# Altium schematic sheet HEADERS & POWER.SchDoc
size B; Organization: Altium Limited; Address1: L3, 12a Rodborough Rd; Address2: Frenchs Forest; Address3: NSW; Address4: Australia 2086
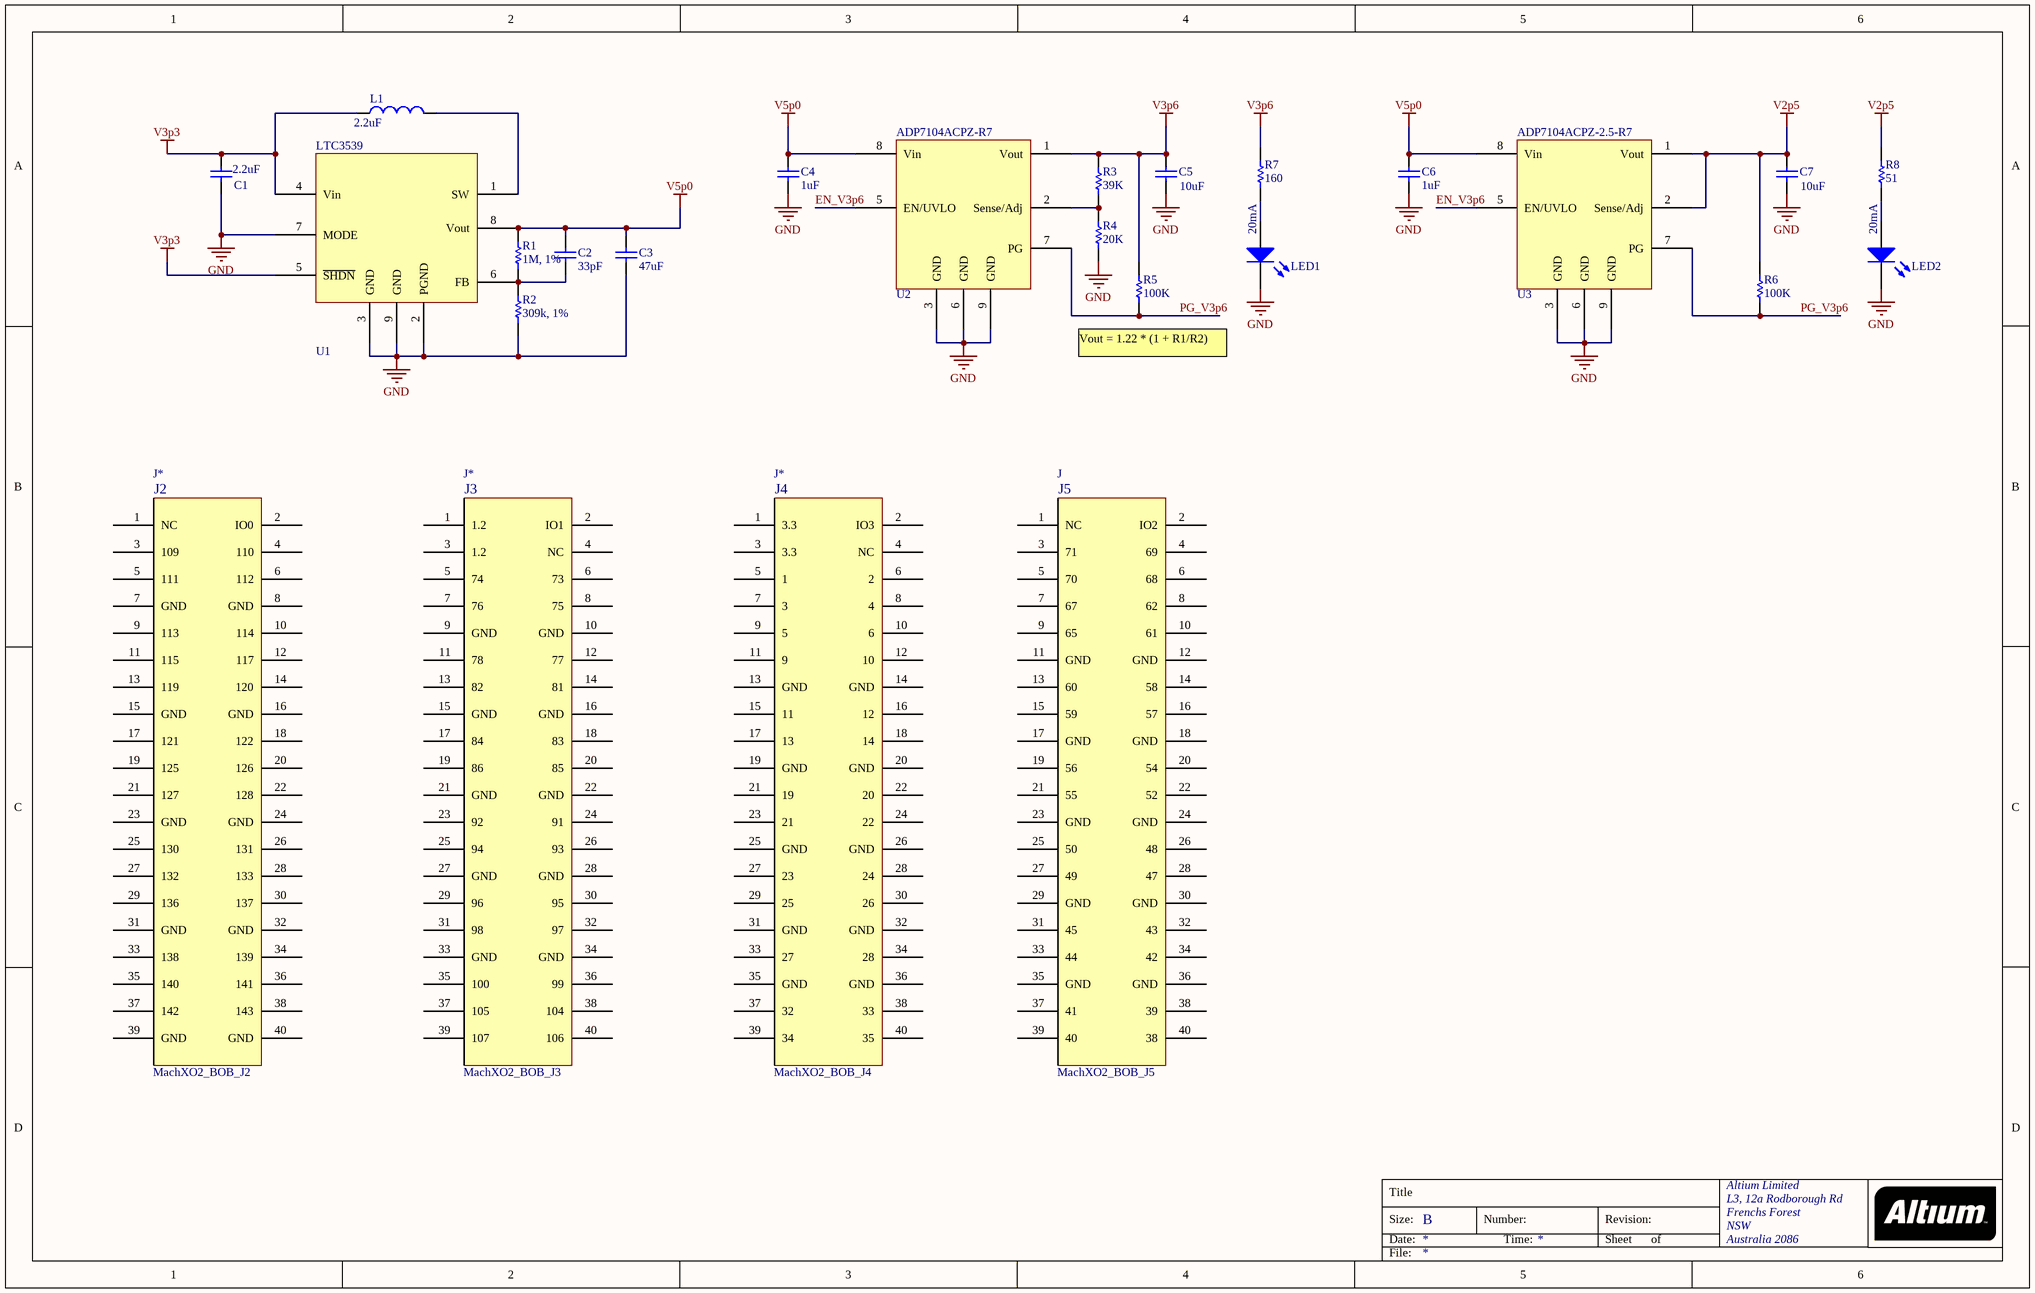
[diagram p0: HEADERS & POWER.SchDoc]

## Parts
(Parts that share a designator on the sheet are numbered #1, #2 ... from top to bottom, then left to right.)
C1  value 2.2uF  [CAPC1206(3216)170_N]  (hidden comment: 587-1329-2-ND)
C2  value 33pF  [CAPC01005(0402)22_N]  (hidden comment: CAP, 0402, 33pF)
C3  value 47uF  [CAPC1206(3216)170_N]  (hidden comment: CAP, 1206, 47uF)
C4  value 1uF  [CAPC01005(0402)22_N]  (hidden comment: CAP, 0402, 1uF)
C5  value 10uF  [CAPC0805(2012)130_N]  (hidden comment: CAP, 0805, 10uF)
C6  value 1uF  [CAPC01005(0402)22_N]  (hidden comment: CAP, 0402, 1uF)
C7  value 10uF  [CAPC0805(2012)130_N]  (hidden comment: CAP, 0805, 10uF)
J  MachXO2_BOB_J5  [RECEPTACLE_25.4MM_20X2]
J*#1  MachXO2_BOB_J2  [RECEPTACLE_25.4MM_20X2]
J*#2  MachXO2_BOB_J3  [RECEPTACLE_25.4MM_20X2]
J*#3  MachXO2_BOB_J4  [RECEPTACLE_25.4MM_20X2]
L1  value 2.2uF  [INDUCTOR, SMD, TDK]  (hidden comment: INDUCTOR, SMD, 2.2uF)
LED1  LED, GREEN, 0603, LITE-ON  [0603, LED]  (value not drawn)
LED2  LED, GREEN, 0603, LITE-ON  [0603, LED]  (value not drawn)
R1  value 1M, 1%  [RESC0402(1005)_N]  (hidden comment: RES, 0402, 1M, 1%)
R2  value 309k, 1%  [RESC0402(1005)_N]  (hidden comment: RES, 0402, 309k, 1%)
R3  39K  [RES, 0603]
R4  20K  [RES, 0603]
R5  100K  [RES, 0603]
R6  100K  [RES, 0603]
R7  160  [RESC1005X04N]
R8  51  [RESC1005X04N]
U1  LTC3539  [QFN45P300X200X80-8N]
U2  ADP7104ACPZ-R7  [QFN50P300X300X75-8N]
U3  ADP7104ACPZ-2.5-R7  [QFN50P300X300X75-8N]

## Nets
GND: C1.1 C3.1 C4.1 C5.1 C6.1 C7.1 LED1.1(C) LED2.1(C) R2.1 R4.1 U1.2(PGND) U1.3(GND) U1.7(MODE) U1.9(GND) U2.3(GND) U2.6(GND) U2.9(GND) U3.3(GND) U3.6(GND) U3.9(GND)
V2p5: C7.2 R6.2 R8.2 U3.1(Vout) U3.2(Sense/Adj)
V3p3: C1.2 L1.1 U1.4(Vin) U1.5(~{SHDN})
V3p6: C5.2 R3.2 R5.2 R7.2 U2.1(Vout)
V5p0: C2.2 C3.2 C4.2 C6.2 R1.2 U1.8(Vout) U2.8(Vin) U3.8(Vin)
EN_V3p6: U2.5(EN/UVLO) U3.5(EN/UVLO)
PG_V3p6: R5.1 R6.1 U2.7(PG) U3.7(PG)
NetC2_1: C2.1 R1.1 R2.2 U1.6(FB)
NetL1_2: L1.2 U1.1(SW)
NetLED1_2: LED1.2(A) R7.1
NetLED2_2: LED2.2(A) R8.1
NetR3_1: R3.1 R4.2 U2.2(Sense/Adj)

Not connected (* = marked no-connect by the designer): J 1(NC) 2(IO2) 3(71) 4(69) 5(70) 6(68) 7(67) 8(62) 9(65) 10(61) 11(GND) 12(GND) 13(60) 14(58) 15(59) 16(57) 17(GND) 18(GND) 19(56) 20(54) 21(55) 22(52) 23(GND) 24(GND) 25(50) 26(48) 27(49) 28(47) 29(GND) 30(GND) 31(45) 32(43) 33(44) 34(42) 35(GND) 36(GND) 37(41) 38(39) 39(40) 40(38); J*#1 1(NC) 2(IO0) 3(109) 4(110) 5(111) 6(112) 7(GND) 8(GND) 9(113) 10(114) 11(115) 12(117) 13(119) 14(120) 15(GND) 16(GND) 17(121) 18(122) 19(125) 20(126) 21(127) 22(128) 23(GND) 24(GND) 25(130) 26(131) 27(132) 28(133) 29(136) 30(137) 31(GND) 32(GND) 33(138) 34(139) 35(140) 36(141) 37(142) 38(143) 39(GND) 40(GND); J*#2 1(1.2) 2(IO1) 3(1.2) 4(NC) 5(74) 6(73) 7(76) 8(75) 9(GND) 10(GND) 11(78) 12(77) 13(82) 14(81) 15(GND) 16(GND) 17(84) 18(83) 19(86) 20(85) 21(GND) 22(GND) 23(92) 24(91) 25(94) 26(93) 27(GND) 28(GND) 29(96) 30(95) 31(98) 32(97) 33(GND) 34(GND) 35(100) 36(99) 37(105) 38(104) 39(107) 40(106); J*#3 1(3.3) 2(IO3) 3(3.3) 4(NC) 5(1) 6(2) 7(3) 8(4) 9(5) 10(6) 11(9) 12(10) 13(GND) 14(GND) 15(11) 16(12) 17(13) 18(14) 19(GND) 20(GND) 21(19) 22(20) 23(21) 24(22) 25(GND) 26(GND) 27(23) 28(24) 29(25) 30(26) 31(GND) 32(GND) 33(27) 34(28) 35(GND) 36(GND) 37(32) 38(33) 39(34) 40(35)

## Notes on the sheet
- 20mA
- (near R5) Vout = 1.22 * (1 + R1/R2)
- Title
- Size:
- Date:
- B
- Number:
- Time:
- Revision:
- Sheet
- of
- File:
- (in symbol MachXO2_BOB_J2) J2
- (in symbol MachXO2_BOB_J3) J3
- (in symbol MachXO2_BOB_J4) J4
- (in symbol MachXO2_BOB_J5) J5

## Library data of the parts
C1 = CAP, 1206, 2.2uF: Supplier 1: Digi-Key; Supplier Part Number 1: 587-1329-1-ND
R3 = RES_0603_39K: Resistor, 0603, 1/10W, 39K ohm; Manufacturer: Panasonic Electronic Components; Manufacturer Part Number: ERJ-3EKF3902V; Description: RES 39K OHM 1/10W 1% 0603 SMD; Tolerance: ±1%; Power (Watts): 0.1W, 1/10W; Temperature Coefficient: ±100ppm/°C; Supplier 1: Digi-Key; RoHS: RoHS Compliant; Category: Resistors; Stock 1: 188167; Pricing 1: 1=0.1, 50=0.0138, 100=0.0105, 250=0.0078, 500=0.00576, 1000=0.00384 (USD); Packaging: Cut Tape (CT); Resistance (Ohms): 39k; Composition: Thick Film; Features: -; Package / Case: 0603 (1608 Metric); Supplier Device Package: 0603; Size / Dimension: 0.063" L x 0.031" W (1.60mm x 0.80mm); Height: 0.022" (0.55mm); Number of Terminations: 2; ComponentLink1URL: http://industrial.panasonic.com/www-cgi/jvcr13pz.cgi?E+PZ+3+AOA0002+ERJ3EKF3902V+7+WW; ComponentLink1Description: http://industrial.panasonic.com/www-cgi/jvcr13pz.cgi?E+PZ+3+AOA0002+ERJ3EKF3902V+7+WW; Supplier Part Number 1: P39.0KHCT-ND
R4 = RES_0603_20K: Resistor, 0603, 1/10W, 20K ohm; Manufacturer: Panasonic Electronic Components; Manufacturer Part Number: ERJ-3EKF2002V; Description: RES 20K OHM 1/10W 1% 0603 SMD; Tolerance: ±1%; Power (Watts): 0.1W, 1/10W; Temperature Coefficient: ±100ppm/°C; Supplier 1: Digi-Key; RoHS: RoHS Compliant; Category: Resistors; Stock 1: 1265750; Pricing 1: 1=0.1, 50=0.0138, 100=0.0105, 250=0.0078, 500=0.00576, 1000=0.00384 (USD); Packaging: Cut Tape (CT); Resistance (Ohms): 20k; Composition: Thick Film; Features: -; Package / Case: 0603 (1608 Metric); Supplier Device Package: 0603; Size / Dimension: 0.063" L x 0.031" W (1.60mm x 0.80mm); Height: 0.022" (0.55mm); Number of Terminations: 2; ComponentLink1URL: http://industrial.panasonic.com/www-cgi/jvcr13pz.cgi?E+PZ+3+AOA0002+ERJ3EKF2002V+7+WW; ComponentLink1Description: http://industrial.panasonic.com/www-cgi/jvcr13pz.cgi?E+PZ+3+AOA0002+ERJ3EKF2002V+7+WW; Supplier Part Number 1: P20.0KHCT-ND
R5 R6 = RES_0603_100K: Resistor, 0603, 1/10W, 100K ohm; Manufacturer: Panasonic Electronic Components; Manufacturer Part Number: ERJ-3EKF1003V; Description: RES 100K OHM 1/10W 1% 0603 SMD; Tolerance: ±1%; Power (Watts): 0.1W, 1/10W; Temperature Coefficient: ±100ppm/°C; Supplier 1: Digi-Key; RoHS: RoHS Compliant; Category: Resistors; Stock 1: 6711812; Pricing 1: 1=0.1, 50=0.0138, 100=0.0105, 250=0.0078, 500=0.00576, 1000=0.00384 (USD); Packaging: Cut Tape (CT); Resistance (Ohms): 100k; Composition: Thick Film; Features: -; Package / Case: 0603 (1608 Metric); Supplier Device Package: 0603; Size / Dimension: 0.063" L x 0.031" W (1.60mm x 0.80mm); Height: 0.022" (0.55mm); Number of Terminations: 2; ComponentLink1URL: http://industrial.panasonic.com/www-cgi/jvcr13pz.cgi?E+PZ+3+AOA0002+ERJ3EKF1003V+7+WW; ComponentLink1Description: http://industrial.panasonic.com/www-cgi/jvcr13pz.cgi?E+PZ+3+AOA0002+ERJ3EKF1003V+7+WW; Supplier Part Number 1: P100KHCT-ND
R7 = RES_0402_160: Resistor, 0402, 1/10W, 160 ohm; Manufacturer: Panasonic Electronic Components; Manufacturer Part Number: ERJ-2RKF1600X; Description: RES 160 OHM 1/10W 1% 0402 SMD; Tolerance: ±1%; Power (Watts): 0.1W, 1/10W; Temperature Coefficient: ±100ppm/°C; Supplier 1: Digi-Key; RoHS: RoHS Compliant; Category: Resistors; Stock 1: 24822; Pricing 1: 1=0.1, 50=0.0242, 100=0.0184, 250=0.01364, 500=0.01008, 1000=0.00672, 5000=0.00473 (USD); Packaging: Cut Tape (CT); Resistance (Ohms): 160; Composition: Thick Film; Features: -; Package / Case: 0402 (1005 Metric); Supplier Device Package: 0402; Size / Dimension: 0.039" L x 0.020" W (1.00mm x 0.50mm); Height: 0.016" (0.40mm); Number of Terminations: 2; ComponentLink1URL: http://industrial.panasonic.com/www-cgi/jvcr13pz.cgi?E+PZ+3+AOA0002+ERJ2RKF1600X+7+WW; ComponentLink1Description: http://industrial.panasonic.com/www-cgi/jvcr13pz.cgi?E+PZ+3+AOA0002+ERJ2RKF1600X+7+WW; Supplier Part Number 1: P160LCT-ND
R8 = RES_0402_51: Resistor, 0402, 1/10W, 51 ohm; Manufacturer: Panasonic Electronic Components; Manufacturer Part Number: ERJ-2RKF51R0X; Description: RES 51 OHM 1/10W 1% 0402 SMD; Tolerance: ±1%; Power (Watts): 0.1W, 1/10W; Temperature Coefficient: ±100ppm/°C; Supplier 1: Digi-Key; RoHS: RoHS Compliant; Category: Resistors; Stock 1: 127224; Pricing 1: 1=0.1, 50=0.0242, 100=0.0184, 250=0.01364, 500=0.01008, 1000=0.00672, 5000=0.00473 (USD); Packaging: Cut Tape (CT); Resistance (Ohms): 51; Composition: Thick Film; Features: -; Package / Case: 0402 (1005 Metric); Supplier Device Package: 0402; Size / Dimension: 0.039" L x 0.020" W (1.00mm x 0.50mm); Height: 0.016" (0.40mm); Number of Terminations: 2; ComponentLink1URL: http://industrial.panasonic.com/www-cgi/jvcr13pz.cgi?E+PZ+3+AOA0002+ERJ2RKF51R0X+7+WW; ComponentLink1Description: http://industrial.panasonic.com/www-cgi/jvcr13pz.cgi?E+PZ+3+AOA0002+ERJ2RKF51R0X+7+WW; Supplier Part Number 1: P51.0LCT-ND
U2 = ADP7104ACPZ-R7: Adjustable Voltage Regulator; Supplier 1: Digi-Key; Supplier Part Number 1: ADP7104ACPZ-R7CT-ND
U3 = ADP7104ACPZ-2.5-R7: 2.5V Voltage Regulator; Supplier 1: Digi-Key; Supplier Part Number 1: ADP7104ACPZ-2.5-R7CT-ND
C2 = CAP, 0402, 33pF: Supplier 1: Digi-Key; Supplier Part Number 1: 587-1205-1-ND
C3 = CAP, 1206, 47uF: Supplier 1: Digi-Key; Supplier Part Number 1: 445-8047-1-ND
C4 C6 = CAP, 0402, 1uF: Supplier 1: Digi-Key; Supplier Part Number 1: 587-3245-1-ND
C5 C7 = CAP, 0805, 10uF: Supplier 1: Digi-Key; Supplier Part Number 1: 587-2985-1-ND
L1 = INDUCTOR, SMD, 2.2uF: Supplier 1: Digi-Key; Supplier Part Number 1: 445-4242-1-ND
LED1 LED2 = LED, GREEN, 0603, LITE-ON: Supplier 1: Digi-Key; Supplier Part Number 1: 160-1446-1-ND
R1 = RES, 0402, 1M, 1%: Supplier 1: Digi-Key; Supplier Part Number 1: P1.00MLCT-ND
R2 = RES, 0402, 309k, 1%: Supplier 1: Digi-Key; Supplier Part Number 1: RHM309KBHCT-ND
U1 = LTC3539: Supplier 1: Digi-Key; Supplier Part Number 1: LTC3539EDCB#TRMPBFTR-ND